# EAGLE schematic eagle (EAGLE 8.1.0)
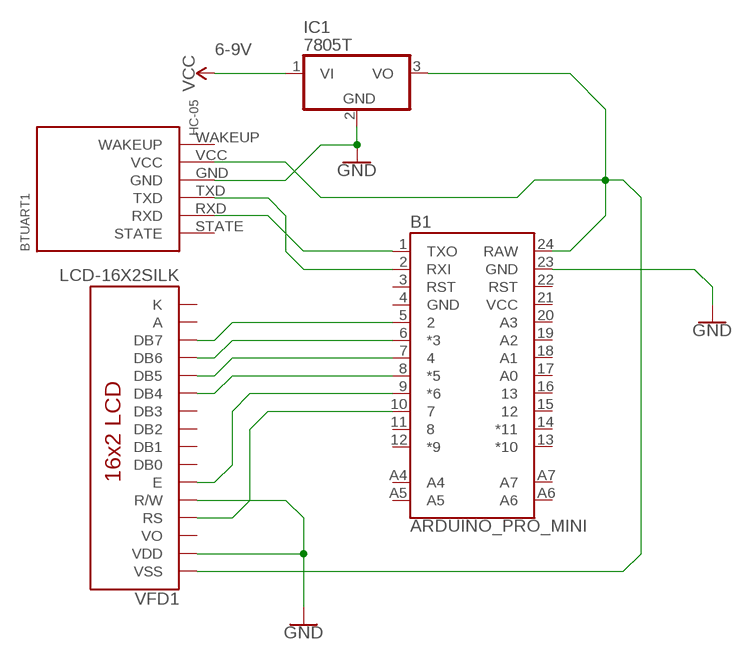
[diagram p0: schematic, sheet 1]

## Parts
B1  ARDUINO_PRO_MINI  [ARDUINO_PRO_MINI]
BTUART1  HC-05  [HC-05-UART]
IC1  7805T  [TO220H]
VFD1  LCD-16X2SILK  [LCD-16X2]

## Nets
GND: B1.23(GND) BTUART1.GND IC1.2(GND) VFD1.2(VDD) VFD1.5(R/W)
N$2: B1.2(RXI) BTUART1.TXD
N$3: B1.24(RAW) BTUART1.VCC IC1.3(VO) VFD1.1(VSS)
N$4: B1.1(TXO) BTUART1.RXD
N$5: B1.5 VFD1.14(DB7)
N$6: B1.6(*3) VFD1.13(DB6)
N$7: B1.7 VFD1.12(DB5)
N$8: B1.8(*5) VFD1.11(DB4)
N$9: B1.9(*6) VFD1.6(E)
N$10: B1.10 VFD1.4(RS)
VCC: IC1.1(VI)
Unconnected: B1.3(RST) B1.11 B1.12(*9) B1.13(*10) B1.14(*11) B1.15 B1.16 B1.17(A0) B1.18(A1) B1.19(A2) B1.20(A3) B1.22(RST) B1.A4 B1.A5 B1.A6 B1.A7 BTUART1.STATE BTUART1.WAKEUP VFD1.3(VO) VFD1.7(DB0) VFD1.8(DB1) VFD1.9(DB2) VFD1.10(DB3)

## Notes on the sheet
- 6-9V

## Power pins joined to a net without a drawn wire
A: VFD1.15(A)
GND: B1.4(GND)
K: VFD1.16(K)
VCC: B1.21(VCC)

## Library data of the parts
B1 = SparkFun-Boards:ARDUINO_PRO_MINI: SparkFun Pro Mini Pro Mini compatible footprint. Dimensions: 0.7 x 1.3" PCB Thickness: 0.8mm SparkFun Products: 3.3V/8MHz <https://www.sparkfun.com/products/11114> 5V/16MHz <https://www.sparkfun.com/products/11113>
BTUART1 = HC-05TTL:HC-05
IC1 = linear:78*: Positive VOLTAGE REGULATOR Source: http://cache.national.com/ds/LM/LM78L05.pdf http://www.fairchildsemi.com/ds/LM/LM7805.pdf
VFD1 = SparkFun-Displays:LCD-16X2: Standard text-only 16x2 parallel input LCD Basic 16 character by 2 line display. Typically utilizes the extremely common HD44780 parallel interface chipset SparkFun Products: Basic 16x2 Green <https://www.sparkfun.com/products/255> Basic 8x2 Green <https://www.sparkfun.com/products/11122>; SF_ID: LCD-00255